# EAGLE design FAN-zero30-SHIM (EAGLE 9.6.2)
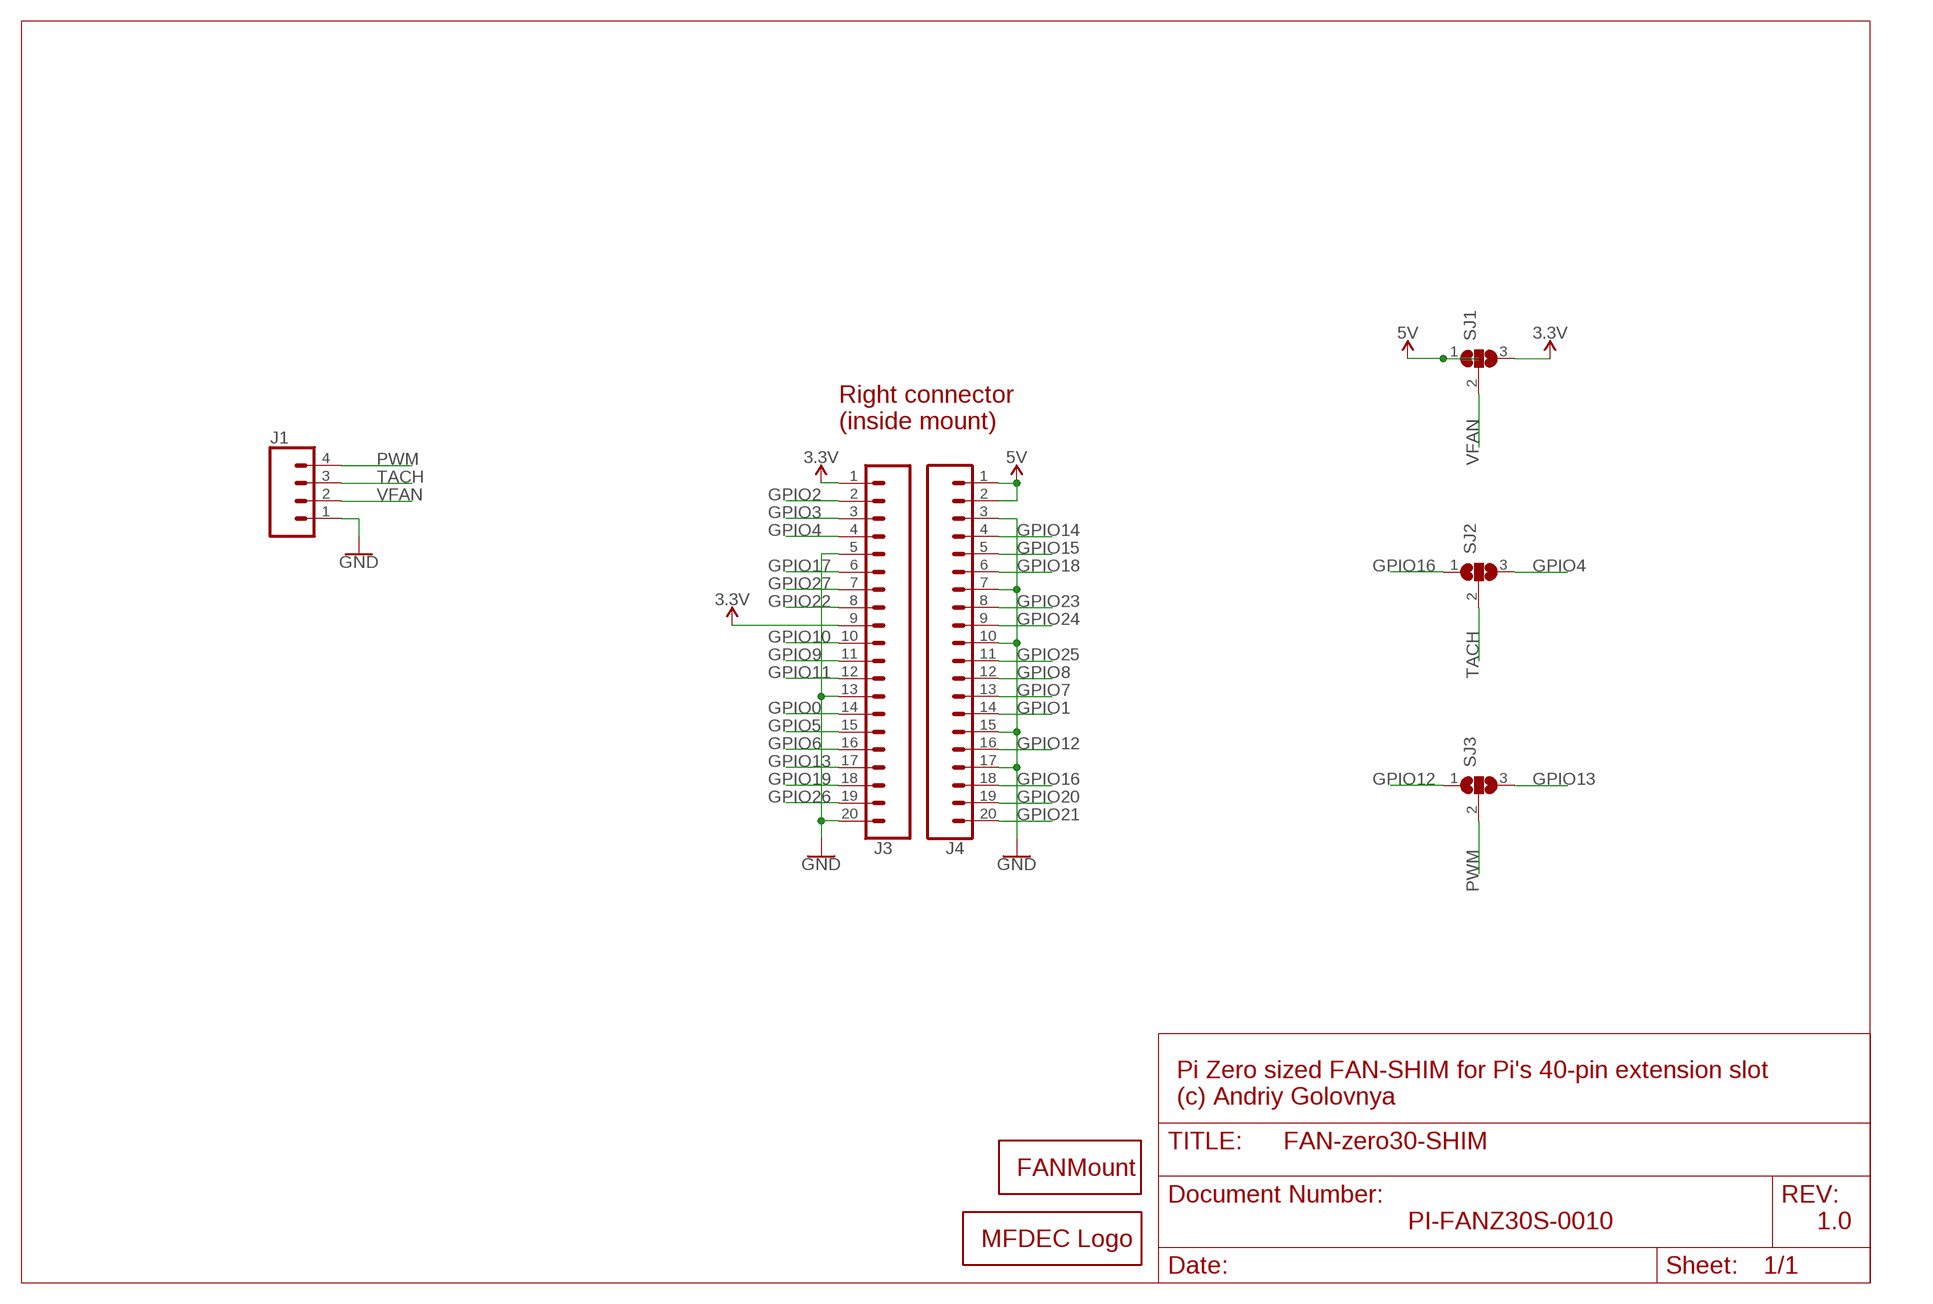
[diagram p0: schematic, sheet 1]

## Parts
FAN1  FAN30HO  [FAN30HO]
J1  CONN_04  [1X04]
J3  CONN_20LOCK  [1X20_LOCK]
J4  CONN_20LOCK  [1X20_LOCK]
LOGO1  MFDECLOGO_L_30MM  [MFDEC_L_30MM]
SJ1  SJ2  [SJ_2]
SJ2  SJ2  [SJ_2]
SJ3  SJ2  [SJ_2]

## Nets
3.3V: J3.1 J3.9 SJ1.3
5V: J4.1 J4.2 SJ1.1
GND: J1.1 J3.5 J3.13 J3.20 J4.3 J4.7 J4.10 J4.15 J4.17
GPIO0: J3.14
GPIO1: J4.14
GPIO2: J3.2
GPIO3: J3.3
GPIO4: J3.4 SJ2.3
GPIO5: J3.15
GPIO6: J3.16
GPIO7: J4.13
GPIO8: J4.12
GPIO9: J3.11
GPIO10: J3.10
GPIO11: J3.12
GPIO12: J4.16 SJ3.1
GPIO13: J3.17 SJ3.3
GPIO14: J4.4
GPIO15: J4.5
GPIO16: J4.18 SJ2.1
GPIO17: J3.6
GPIO18: J4.6
GPIO19: J3.18
GPIO20: J4.19
GPIO21: J4.20
GPIO22: J3.8
GPIO23: J4.8
GPIO24: J4.9
GPIO25: J4.11
GPIO26: J3.19
GPIO27: J3.7
PWM: J1.4 SJ3.2
TACH: J1.3 SJ2.2
VFAN: J1.2 SJ1.2

## Notes on the sheet
- Right connector
  (inside mount)
- Pi Zero sized FAN-SHIM for Pi's 40-pin extension slot
  (c) Andriy Golovnya
- PI-FANZ30S-0010 | 1.0

## Library data of the parts
FAN1 = _my_fans:FAN: 30mm and 40mm fan mount holes
J1 = SparkFun-Connectors:CONN_04: Multi connection point. Often used as Generic Header-pin footprint for 0.1 inch spaced/style header connections On any of the 0.1 inch spaced packages, you can populate with these: Break Away Headers - Straight <https://www.sparkfun.com/products/116> (PRT-00116) Break Away Male Headers - Right Angle <https://www.sparkfun.com/products/553> (PRT-00553) Female Headers <https://www.sparkfun.com/products/115> (PRT-00115) Break Away Headers - Machine Pin <https://www.sparkfun.com/products/117> (PRT-00117) Break Away Female Headers - Swiss Machine Pin <https://www.sparkfun.com/products/743> (PRT-00743) For SCREWTERMINALS and SPRING TERMINALS visit here: Screw Terimnals on SparkFun.com <https://www.sparkfun.com/search/results?term=Screw+Terminals> (5mm/3.5mm/2.54mm spacing) This device is also useful as a general connection point to wire up your design to another part of your project. Our various solder wires solder well into these plated through hole pads. Hook-Up Wire - Assortment (Stranded, 22 AWG) <https://www.sparkfun.com/products/11375> (PRT-11375) Hook-Up Wire - Assortment (Solid Core, 22 AWG) <https://www.sparkfun.com/products/11367> (PRT-11367) View the entire wire category on our website here <https://www.sparkfun.com/categories/141> Special notes: Molex polarized connector foot print use with SKU : PRT-08231 with associated crimp pins and housings. 1MM SMD Version SKU: PRT-10208; PROD_ID: CONN-09696
J3 J4 = _my_locked_connectors:CONN_20: Multi connection point. Often used as Generic Header-pin footprint for 0.1 inch spaced/style header connections On any of the 0.1 inch spaced packages, you can populate with these: Break Away Headers - Straight <https://www.sparkfun.com/products/116> (PRT-00116) Break Away Male Headers - Right Angle <https://www.sparkfun.com/products/553> (PRT-00553) Female Headers <https://www.sparkfun.com/products/115> (PRT-00115) Break Away Headers - Machine Pin <https://www.sparkfun.com/products/117> (PRT-00117) Break Away Female Headers - Swiss Machine Pin <https://www.sparkfun.com/products/743> (PRT-00743) For SCREWTERMINALS and SPRING TERMINALS visit here: Screw Terimnals on SparkFun.com <https://www.sparkfun.com/search/results?term=Screw+Terminals> (5mm/3.5mm/2.54mm spacing) This device is also useful as a general connection point to wire up your design to another part of your project. Our various solder wires solder well into these plated through hole pads. Hook-Up Wire - Assortment (Stranded, 22 AWG) <https://www.sparkfun.com/products/11375> (PRT-11375) Hook-Up Wire - Assortment (Solid Core, 22 AWG) <https://www.sparkfun.com/products/11367> (PRT-11367) View the entire wire category on our website here <https://www.sparkfun.com/categories/141> Special notes: Molex polarized connector foot print use with SKU : PRT-08231 with associated crimp pins and housings. 1MM SMD Version SKU: PRT-10208 NOTES ON THE VARIANTS LOCK and LOCK_LONGPADS... This footprint was designed to help hold the alignment of a through-hole component (i.e. 6-pin header) while soldering it into place. You may notice that each hole has been shifted either up or down by 0.005 of an inch from it's more standard position (which is a perfectly straight line). This slight alteration caused the pins (the squares in the middle) to touch the edges of the holes. Because they are alternating, it causes a "brace" to hold the component in place. 0.005 has proven to be the perfect amount of "off-center" position when using our standard breakaway headers. Although looks a little odd when you look at the bare footprint, once you have a header in there, the alteration is very hard to notice. Also,if you push a header all the way into place, it is covered up entirely on the bottom side. Note about LOCK SPECIAL package: This is just like the LOCK variant in that the holes are staggared by 5 mil, but except for the last two holes. They are not altered from the "standard" footprint layout. This is used for a special purpose on the layout of our Graphic LCD Backpack. Make sure you want to use this device before selecting it for you project!
LOGO1 = _my_logos:MFDECLOGO: Midnight Fog - Digital Eye Candy LOGO
SJ1-SJ3 = _my_jumpers:SJ2: SMD solder JUMPER SJ2 - simple jumper SJ2FI - fancy inside jumper SJ2FO - fancy outside jumper SJ2FL - fancy left jumper SJ2FR - fancy right jumper SJ2W - wide jumper

## Board
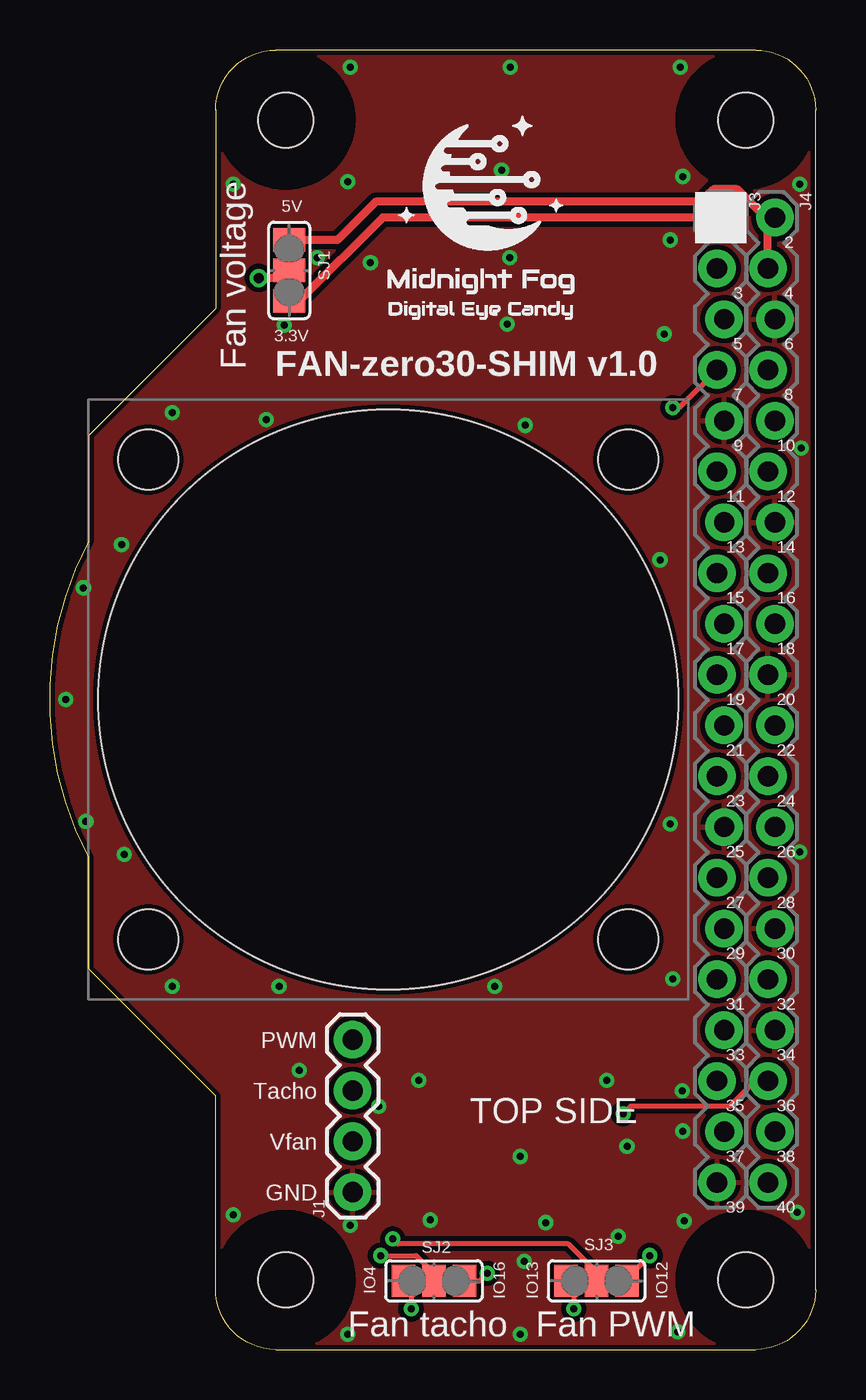
[diagram p1: board, top side]
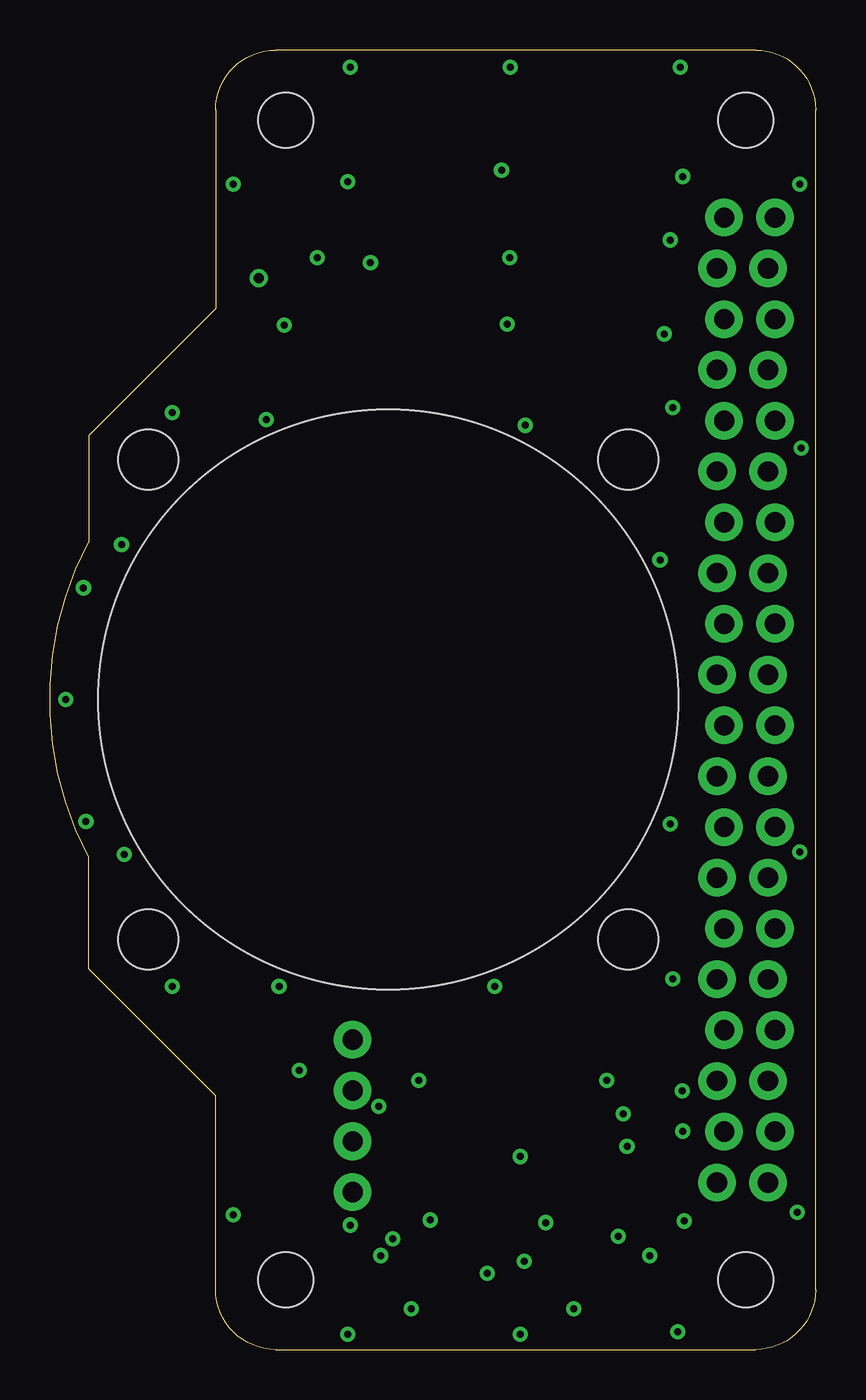
[diagram p2: board, inner layer Route2]
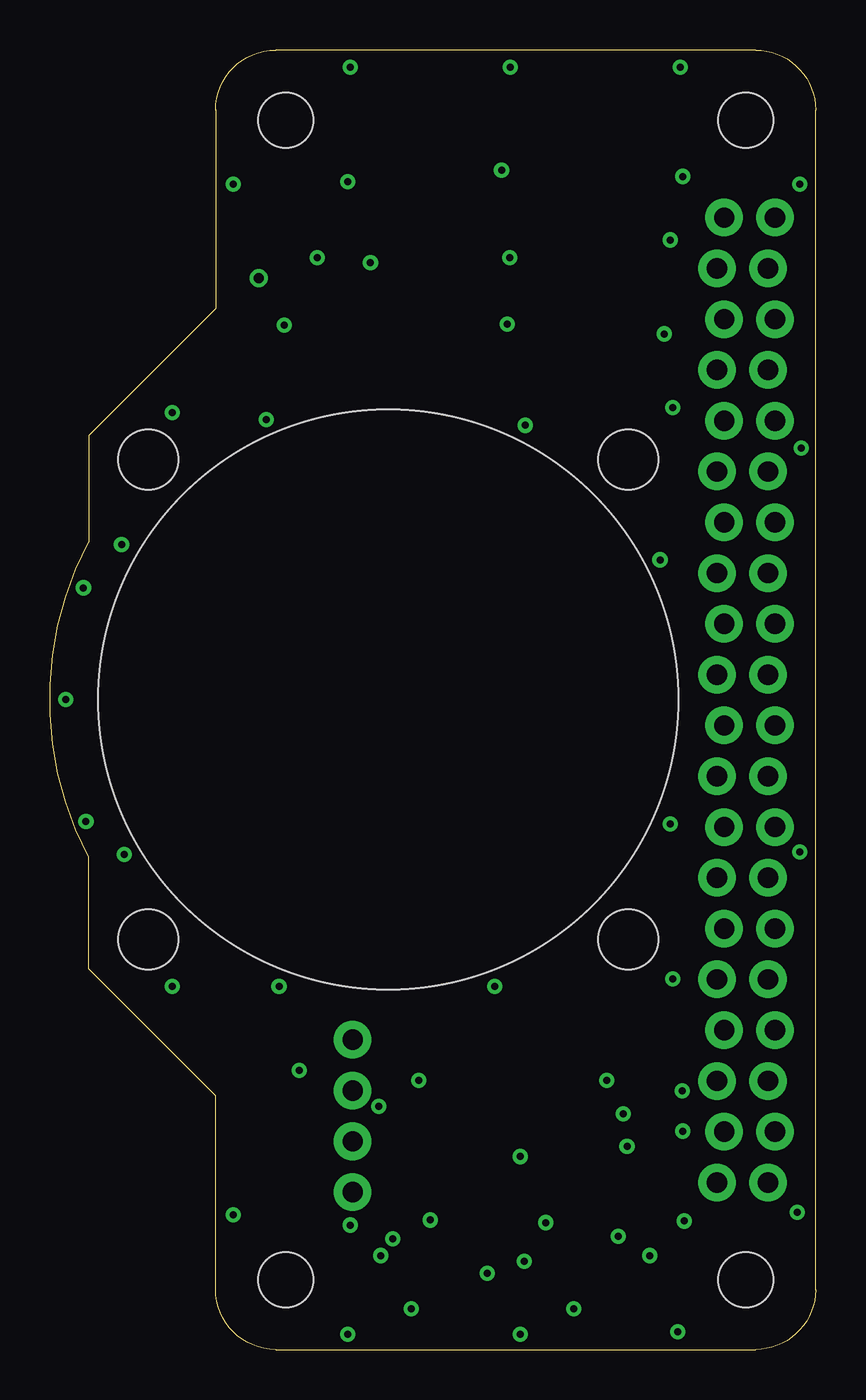
[diagram p3: board, inner layer Route15]
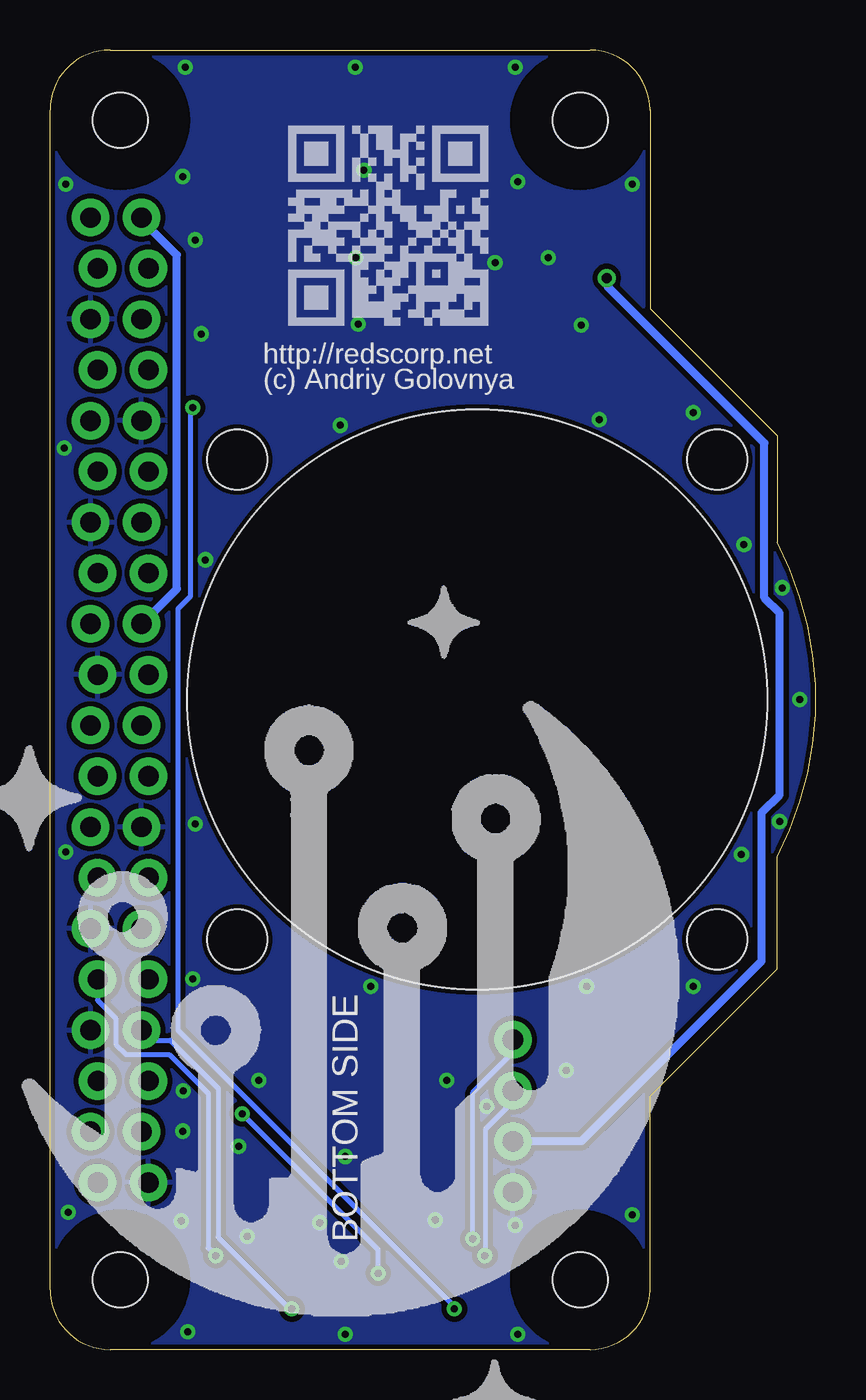
[diagram p4: board, bottom side, seen from below]

Size 38.28 x 65 mm. Coordinates in mm from the lower left corner, seen from the top.
Outline: 8.28,3 arc90 11.28,0 35.28,0 arc90 38.28,3 38.28,62 arc90 35.28,65 11.28,65 arc90 8.28,62
Outline: 8.28,3 arc0 8.28,3
Outline: 8.28,62 arc0 8.28,62
Outline: 8.28,3 8.28,12.7 1.93,19.05 1.93,24.64 arc-55 1.93,40.39 1.93,45.72 8.28,52.07 8.28,62
Copper layers (1*16): Top 0.035mm / dielectric 1.5mm / Bottom 0.035mm
Design rules "default *": minimum track width 6mil, minimum drill 0.35mm, track to track 6mil, track to pad 6mil, pad to pad 6mil, via to via 6mil, smd to smd 6mil, copper to edge 6mil, drill to drill 6mil, minimum pad ring 10mil, minimum via ring 8mil, stop-mask expansion 4mil, vias tented up to drill 20mil, thermal gap 10mil
Holes 2.75 mm at 11.78,3.5 34.78,3.5 11.78,61.5 34.78,61.5

### Footprints (pad centres in the part's own frame; a part is rotated, then mirrored left to right if it is on the bottom)
FAN30HO = hole 3: -12,12; 12,12; -12,-12; 12,-12 | hole 29: 0,0
1X04 = drill 1.016 pad 1.88: 1 0,0; 2 2.54,0; 3 5.08,0; 4 7.62,0
1X20_LOCK = drill 1.016 pad 1.88: 1 0,0.178; 2 2.54,-0.178; 3 5.08,0.178; 4 7.62,-0.178; 5 10.16,0.178; 6 12.7,-0.178; 7 15.24,0.178; 8 17.78,-0.178; 9 20.32,0.178; 10 22.86,-0.178; 11 25.4,0.178; 12 27.94,-0.178; 13 30.48,0.178; 14 33.02,-0.178; 15 35.56,0.178; 16 38.1,-0.178; 17 40.64,0.178; 18 43.18,-0.178; 19 45.72,0.178; 20 48.26,-0.178
SJ_2 = smd 1.168 x 1.6: 1 -1.524,0; 2 0,0; 3 1.524,0

### Placement (x,y rotation side)
FAN1  16.91,32.51 0 top
J1  15.13,7.87 90 top
J3  33.53,56.62 270 top
J4  36.07,56.62 270 top
LOGO1  4.09,-7.11 90 bottom  (outside the outline)
LOGO2  MFDECLOGO_SQ_8MM  [MFDEC_SQ_8MM]  16.2,51.21 0 top
LOGO3  RSNURL_QR_10MM  [RSNURL_QR_10MM]  26.36,51.21 0 bottom
SJ1  11.96,53.98 270 top
SJ2  19.2,3.43 180 top
SJ3  27.33,3.43 180 top

### Tracks (layer width: path | path; a pad name or v marks a point on that pad's centre or on a via)
3.3V
  Top 0.406: J3.1 16.63,56.62 12.47,52.45 SJ1.3
  Bottom 0.406: J3.1 33.71,56.52 31.93,54.74 31.93,38.04 33.68,36.3 J3.9
5V
  Top 0.406: J4.2 35.89,56.26 J4.1 35.79,56.62 34.37,58.04 33.17,58.04 32.54,57.4 16.28,57.4 14.37,55.5 SJ1.1
GND  (via drill 0.35)
  other vias: 31.39,0.89 37.36,6.86 14.88,0.76 9.17,6.73 15.01,6.22 19.02,6.48 23.72,4.42 28.85,10.16 24.79,6.35 18.44,13.46 23.52,9.65 11.45,18.16 22.25,18.16 31.01,26.29 31.14,18.54 27.83,13.46 0.78,32.51 6.12,18.16 12.47,13.97 6.12,46.86 9.17,58.29 15.01,64.14 31.52,64.14 37.49,58.29 23.01,64.14 31.64,58.67 31.01,55.5 13.36,54.61 14.88,58.42 16.02,54.36 30.5,39.5 23.77,46.23 10.82,46.51 37.56,45.09 37.49,24.89 16.43,12.17 23.52,0.76 31.62,12.93 31.64,10.92 22.58,58.98 22.98,54.61 30.7,50.8 22.86,51.28 11.71,51.23 28.42,5.66 31.72,6.43 3.58,40.26 1.67,38.1 1.8,26.42 3.7,24.77
  pour Top (isolate 0.254): -0.61,0 -0.61,65.15 38.5,65.15 38.5,0
  pour Bottom (isolate 0.254): -0.61,0 -0.61,65.15 38.5,65.15 38.5,0
GND1
  cutout Top: 34.78,0 arc-180 34.78,7 arc-180
  cutout Route2: 34.78,0 arc-180 34.78,7 arc-180
  cutout Route15: 34.78,0 arc-180 34.78,7 arc-180
  cutout Bottom: 34.78,0 arc-180 34.78,7 arc-180
GND2
  cutout Top: 11.78,58 arc-180 11.78,65 arc-180
  cutout Route2: 11.78,58 arc-180 11.78,65 arc-180
  cutout Route15: 11.78,58 arc-180 11.78,65 arc-180
  cutout Bottom: 11.78,58 arc-180 11.78,65 arc-180
GND3
  cutout Top: 34.78,58 arc-180 34.78,65 arc-180
  cutout Route2: 34.78,58 arc-180 34.78,65 arc-180
  cutout Route15: 34.78,58 arc-180 34.78,65 arc-180
  cutout Bottom: 34.78,58 arc-180 34.78,65 arc-180
GND4
  cutout Top: 11.78,0 arc-180 11.78,7 arc-180
  cutout Route2: 11.78,0 arc-180 11.78,7 arc-180
  cutout Route15: 11.78,0 arc-180 11.78,7 arc-180
  cutout Bottom: 11.78,0 arc-180 11.78,7 arc-180
GPIO4  (via drill 0.35)
  Top 0.254: J3.4 31.47,47.12 v31.14,47.12 | v18.06,2.03 18.06,3.05 SJ2.3
  Bottom 0.254: v31.14,47.12 31.26,46.99 31.26,37.66 31.88,37.05 31.88,15.98 18.06,2.16 v18.06,2.03
GPIO12  (via drill 0.35)
  Top 0.254: SJ3.1 28.85,3.56 v29.99,4.7
  Bottom 0.254: J4.16 35.89,17.47 34.98,16.56 34.98,15.27 34.47,14.76 32.31,14.76 30.37,12.82 30.37,5.08 v29.99,4.7
GPIO13  (via drill 0.35)
  Top 0.254: SJ3.3 26.18,3.05 v26.18,2.03
  Bottom 0.254: J3.17 33.2,15.47 32.26,15.47 29.87,13.07 29.87,5.61 26.29,2.03 v26.18,2.03
GPIO16  (via drill 0.35)
  Top 0.254: J4.18 35.26,13.44 33.99,12.16 29.03,12.16 v28.66,11.79 | v21.87,3.81 21.48,3.43 SJ2.1
  Bottom 0.254: v28.66,11.79 21.87,5 v21.87,3.81
PWM  (via drill 0.35)
  Top 0.254: SJ3.2 27.33,3.85 25.9,5.28 17.39,5.28 v17.14,5.53
  Bottom 0.254: v17.14,5.53 17.14,12.86 15.13,14.86 J1.4
TACH  (via drill 0.35)
  Top 0.254: SJ2.2 18.82,3.81 18.82,4.19 18.31,4.7 v16.53,4.7
  Bottom 0.254: v16.53,4.7 16.48,4.75 16.48,11.05 15.13,12.39 J1.3
VFAN  (via drill 0.5)
  Top 0.152: SJ1.2 11.96,55.07
  Top 0.406: SJ1.2 11.58,53.59 v10.44,53.59
  Bottom 0.406: v10.44,53.59 10.44,53.21 2.56,45.34 2.56,37.6 1.8,36.84 1.8,27.74 2.69,26.85 2.69,19.43 11.71,10.41 J1.2

### Text on the board
tPlace: 5V | 2 | 3 | 4 | 3.3V | 5 | 6 | Fan voltage | FAN-zero30-SHIM v1.0 | 7 | 8 | 9 | 10 | 11 | 12 | 13 | 14 | 15 | 16 | 17 | 18 | 19 | 20 | 21 | 22 | 23 | 24 | 25 | 26 | 27 | 28 | 29 | 30 | 31 | 32 | PWM | 33 | 34 | Tacho | 35 | 36 | Vfan | TOP SIDE | 37 | 38 | GND | 39 | 40 | IO4 | IO16 | IO13 | IO12 | Fan tacho | Fan PWM
bPlace: http://redscorp.net | (c) Andriy Golovnya | BOTTOM SIDE